# EAGLE design sha2017_proto_rev1_0_0 (EAGLE 6.6.0)
Assembly variants: PRODUCTION
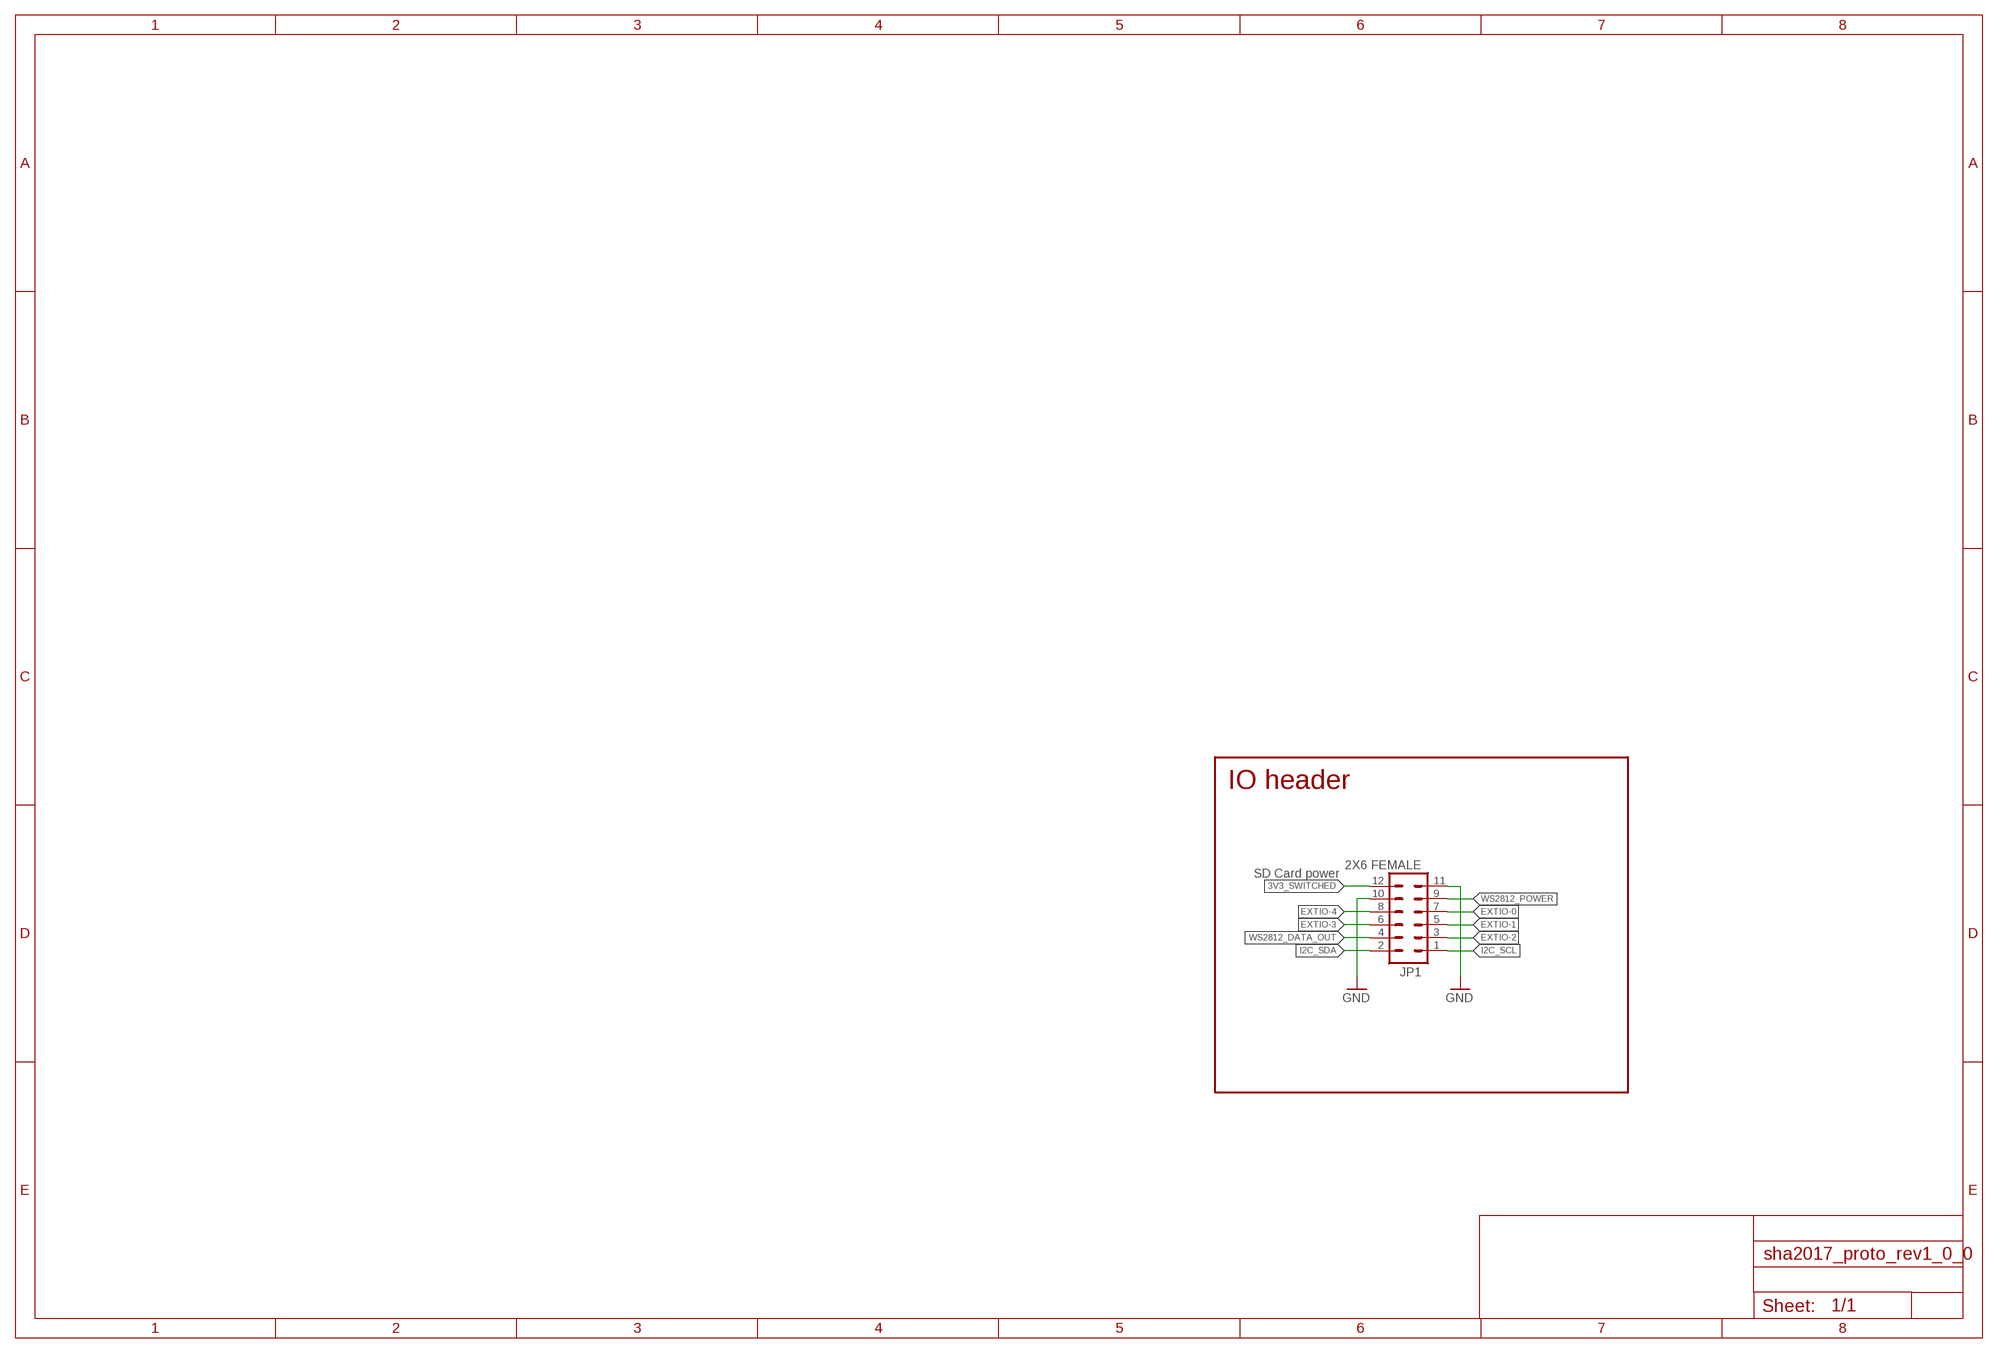
[diagram p0: schematic, sheet 1]

## Parts
JP1  2X6 FEMALE  M06X2PTH_FEMALE  [2X6]

## Nets
3V3_SWITCHED: JP1.12
EXTIO-0: JP1.7
EXTIO-1: JP1.5
EXTIO-2: JP1.3
EXTIO-3: JP1.6
EXTIO-4: JP1.8
GND [GND/3V3]: JP1.10 JP1.11
I2C_SCL: JP1.1
I2C_SDA: JP1.2
WS2812_DATA_OUT: JP1.4
WS2812_POWER: JP1.9

## Notes on the sheet
- IO header
- SD Card power

## Library data of the parts
JP1 = SparkFun-Connectors:M06X2; PROD_ID: CONN-12423

## Net classes
1 FAT: width 0.2 mm, drill 0.4 mm
2 GND/3V3: width 0.2 mm, drill 0.4 mm
3 Touch: width 0.2 mm, clearance 1 mm
4 touch prox: width 0.2 mm, clearance 1.6 mm

## Board
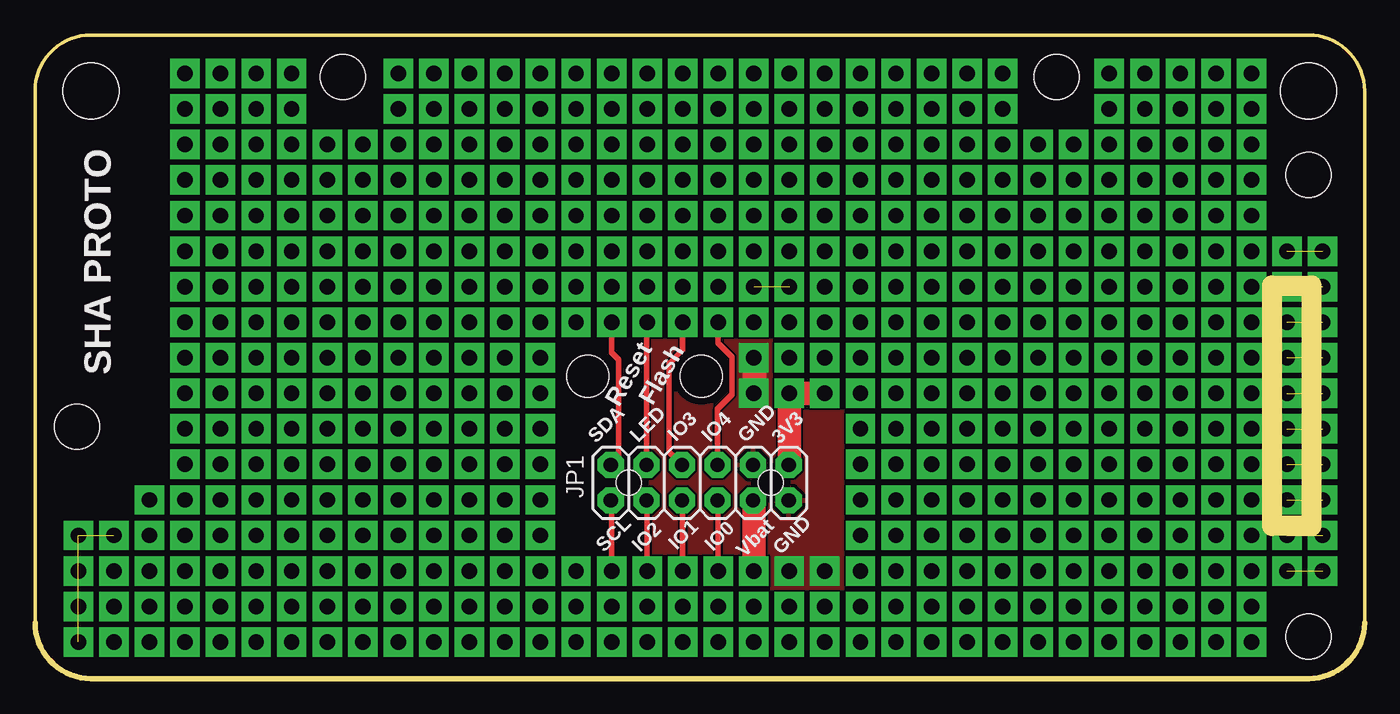
[diagram p1: board, top side]
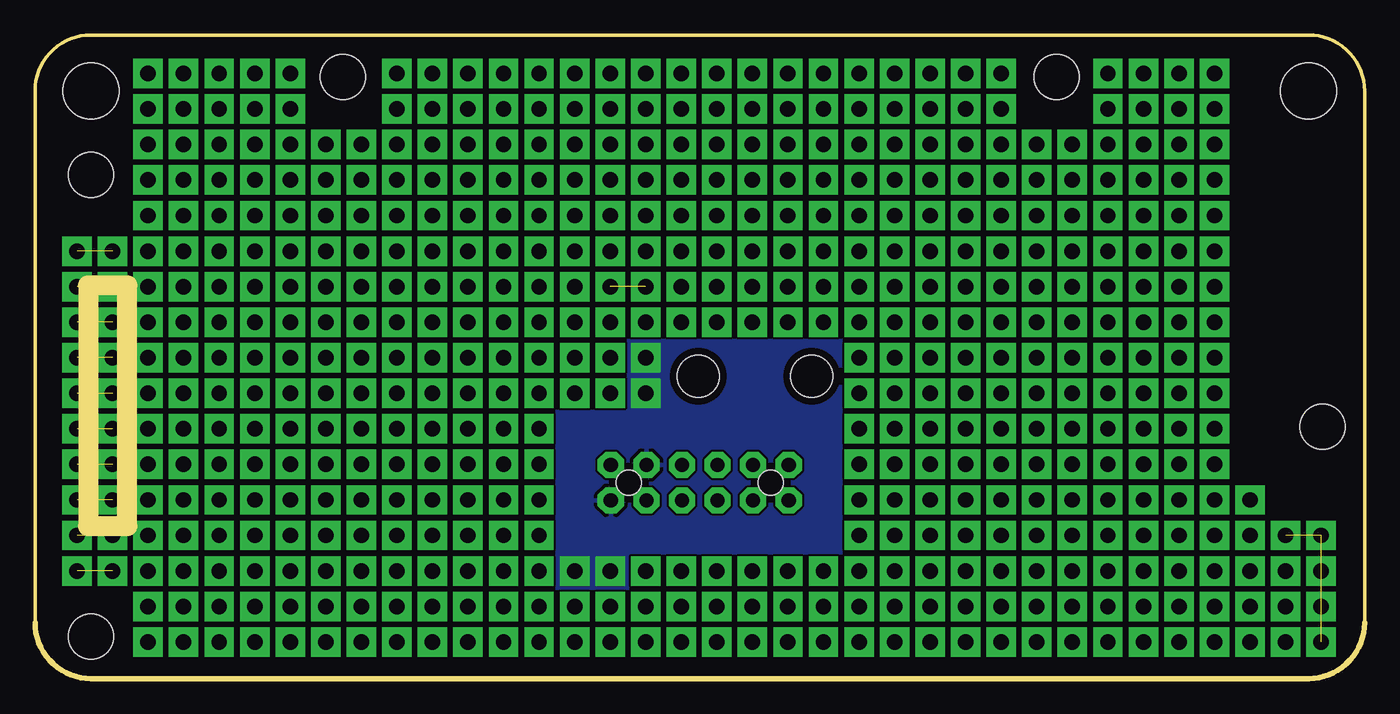
[diagram p2: board, bottom side, seen from below]

Size 95 x 46 mm. Coordinates in mm from the lower left corner, seen from the top.
Outline: 91,46 4,46 arc90 0,42 0,4 arc90 4,0 91,0 arc90 95,4 95,42 arc90 91,46
Copper layers (1*16): Top 0.035mm / dielectric 1.6mm / Bottom 0.035mm
Design rules "Elecrow_2-layer_PCB_eagle_rule": minimum track width 6mil, minimum drill 12mil, track to track 6mil, track to pad 6mil, pad to pad 6mil, via to via 8mil, smd to smd 0mil, copper to edge 20mil, drill to drill 10mil, minimum pad ring 6mil, minimum via ring 6mil, stop-mask expansion 0mil, vias tented up to drill 100mil, thermal gap 10mil
Holes 4 mm at 91,42 4,42
Holes 3.2 mm at 3,18 91,3 91,36 22,43 73,43
Holes 1.8 mm at 42.42,14 52.58,14
Holes 3 mm at 39.5,21.6 47.6,21.6
tRestrict: area -0.3,16.1 to 8.2,46.1
bRestrict: area -0.3,16.1 to 8.2,46.1
Milling: 4 lines

### Footprints (pad centres in the part's own frame; a part is rotated, then mirrored left to right if it is on the bottom)
2X6 = drill 1.016 pad 1.88 octagon: 1 0,0; 2 0,2.54; 3 2.54,0; 4 2.54,2.54; 5 5.08,0; 6 5.08,2.54; 7 7.62,0; 8 7.62,2.54; 9 10.16,0; 10 10.16,2.54; 11 12.7,0; 12 12.7,2.54

### Placement (x,y rotation side)
JP1  41.15,12.73 0 top

### Tracks (layer width: path | path; a pad name or v marks a point on that pad's centre or on a via)
3V3_SWITCHED  (via drill 1.1 pad 2.1)
  Top 1.676: JP1.12 53.9,15.27 v53.9,20.39 v56.44,20.39
EXTIO-0  (via drill 1.1 pad 2.1)
  Top 0.406: JP1.7 48.82,12.73 v48.82,7.69
EXTIO-1  (via drill 1.1 pad 2.1)
  Top 0.406: JP1.5 46.28,12.73 v46.28,7.69
EXTIO-2  (via drill 1.1 pad 2.1)
  Top 0.406: JP1.3 43.74,12.73 v43.74,7.69
EXTIO-3  (via drill 1.1 pad 2.1)
  Top 0.406: v46.28,25.47 46.28,23.48 45.4,22.6 45.3,22.5 45.3,16.2 JP1.6
EXTIO-4  (via drill 1.1 pad 2.1)
  Top 0.406: JP1.8 48.77,19.27 49.8,20.3 49.8,23 48.8,24 48.8,24.8 48.8,25.45 v48.82,25.47
GND  (via drill 1.1 pad 2.1)
  Top 1.676: v51.36,22.93 51.4,22.93 51.4,20.4
  other vias: 53.9,7.69 56.44,7.69 51.36,20.39
  pour Bottom (rank 6): 95.2,42 95.3,0.9 -0.3,1.3 0.6,43.1 arc-90 3.6,46.1 90.7,46.2 arc-90
  pour Top (rank 6): -0.6,46.4 96.1,46.4 96.1,0.9 -1.1,0.9 -1.1,46.5
I2C_SCL  (via drill 1.1 pad 2.1)
  Top 0.406: JP1.1 41.2,12.73 v41.2,7.69
I2C_SDA  (via drill 1.1 pad 2.1)
  Top 0.406: v41.2,25.47 41.2,23.3 41.7,22.8 41.7,15.82 JP1.2
N$9  (via drill 1.1 pad 2.1)
  other vias: 58.98,7.69
N$10  (via drill 1.1 pad 2.1)
  other vias: 61.52,7.69
N$11  (via drill 1.1 pad 2.1)
  other vias: 64.06,7.69
N$12  (via drill 1.1 pad 2.1)
  other vias: 66.6,7.69
N$13  (via drill 1.1 pad 2.1)
  other vias: 69.14,7.69
N$14  (via drill 1.1 pad 2.1)
  other vias: 71.68,7.69
N$15  (via drill 1.1 pad 2.1)
  other vias: 74.22,7.69
N$16  (via drill 1.1 pad 2.1)
  other vias: 76.76,7.69
N$17  (via drill 1.1 pad 2.1)
  other vias: 79.3,7.69
N$18  (via drill 1.1 pad 2.1)
  other vias: 81.84,7.69
N$19  (via drill 1.1 pad 2.1)
  other vias: 5.64,5.15
N$20  (via drill 1.1 pad 2.1)
  other vias: 84.38,7.69
N$21  (via drill 1.1 pad 2.1)
  other vias: 86.92,7.69
N$22  (via drill 1.1 pad 2.1)  (1 unrouted)
  other vias: 89.46,7.69 92,7.69
N$25  (via drill 1.1 pad 2.1)
  other vias: 8.18,5.15
N$26  (via drill 1.1 pad 2.1)
  other vias: 10.72,5.15
N$27  (via drill 1.1 pad 2.1)
  other vias: 13.26,5.15
N$28  (via drill 1.1 pad 2.1)
  other vias: 15.8,5.15
N$32  (via drill 1.1 pad 2.1)
  other vias: 18.34,5.15
N$42  (via drill 1.1 pad 2.1)
  other vias: 20.88,5.15
N$43  (via drill 1.1 pad 2.1)
  other vias: 23.42,5.15
N$44  (via drill 1.1 pad 2.1)
  other vias: 25.96,5.15
N$45  (via drill 1.1 pad 2.1)
  other vias: 28.5,5.15
N$46  (via drill 1.1 pad 2.1)
  other vias: 31.04,5.15
N$47  (via drill 1.1 pad 2.1)
  other vias: 33.58,5.15
N$48  (via drill 1.1 pad 2.1)
  other vias: 36.12,5.15
N$49  (via drill 1.1 pad 2.1)
  other vias: 38.66,5.15
N$50  (via drill 1.1 pad 2.1)
  other vias: 41.2,5.15
N$51  (via drill 1.1 pad 2.1)
  other vias: 43.74,5.15
N$52  (via drill 1.1 pad 2.1)
  other vias: 46.28,5.15
N$53  (via drill 1.1 pad 2.1)
  other vias: 48.82,5.15
N$54  (via drill 1.1 pad 2.1)
  other vias: 51.36,5.15
N$55  (via drill 1.1 pad 2.1)
  other vias: 53.9,5.15
N$56  (via drill 1.1 pad 2.1)
  other vias: 56.44,5.15
N$57  (via drill 1.1 pad 2.1)
  other vias: 5.64,7.69
N$58  (via drill 1.1 pad 2.1)
  other vias: 8.18,7.69
N$59  (via drill 1.1 pad 2.1)
  other vias: 10.72,7.69
N$60  (via drill 1.1 pad 2.1)
  other vias: 13.26,7.69
N$61  (via drill 1.1 pad 2.1)
  other vias: 15.8,7.69
N$62  (via drill 1.1 pad 2.1)
  other vias: 18.34,7.69
N$63  (via drill 1.1 pad 2.1)
  other vias: 20.88,7.69
N$64  (via drill 1.1 pad 2.1)
  other vias: 23.42,7.69
N$65  (via drill 1.1 pad 2.1)
  other vias: 25.96,7.69
N$66  (via drill 1.1 pad 2.1)
  other vias: 28.5,7.69
N$67  (via drill 1.1 pad 2.1)
  other vias: 31.04,7.69
N$68  (via drill 1.1 pad 2.1)
  other vias: 33.58,7.69
N$69  (via drill 1.1 pad 2.1)
  other vias: 36.12,7.69
N$70  (via drill 1.1 pad 2.1)
  other vias: 38.66,7.69
N$72  (via drill 1.1 pad 2.1)
  other vias: 5.64,2.61
N$73  (via drill 1.1 pad 2.1)
  other vias: 58.98,2.61
N$74  (via drill 1.1 pad 2.1)
  other vias: 61.52,2.61
N$75  (via drill 1.1 pad 2.1)
  other vias: 64.06,2.61
N$76  (via drill 1.1 pad 2.1)
  other vias: 66.6,2.61
N$77  (via drill 1.1 pad 2.1)
  other vias: 69.14,2.61
N$78  (via drill 1.1 pad 2.1)
  other vias: 71.68,2.61
N$79  (via drill 1.1 pad 2.1)
  other vias: 74.22,2.61
N$80  (via drill 1.1 pad 2.1)
  other vias: 76.76,2.61
N$81  (via drill 1.1 pad 2.1)
  other vias: 79.3,2.61
N$82  (via drill 1.1 pad 2.1)
  other vias: 81.84,2.61
N$83  (via drill 1.1 pad 2.1)
  other vias: 84.38,2.61
N$84  (via drill 1.1 pad 2.1)
  other vias: 86.92,2.61
N$86  (via drill 1.1 pad 2.1)
  other vias: 8.18,2.61
N$87  (via drill 1.1 pad 2.1)
  other vias: 10.72,2.61
N$88  (via drill 1.1 pad 2.1)
  other vias: 13.26,2.61
N$89  (via drill 1.1 pad 2.1)
  other vias: 58.98,5.15
N$90  (via drill 1.1 pad 2.1)
  other vias: 61.52,5.15
N$91  (via drill 1.1 pad 2.1)
  other vias: 64.06,5.15
N$92  (via drill 1.1 pad 2.1)
  other vias: 66.6,5.15
N$93  (via drill 1.1 pad 2.1)
  other vias: 69.14,5.15
N$94  (via drill 1.1 pad 2.1)
  other vias: 71.68,5.15
N$95  (via drill 1.1 pad 2.1)
  other vias: 74.22,5.15
N$96  (via drill 1.1 pad 2.1)
  other vias: 76.76,5.15
N$97  (via drill 1.1 pad 2.1)
  other vias: 79.3,5.15
N$98  (via drill 1.1 pad 2.1)
  other vias: 81.84,5.15
N$99  (via drill 1.1 pad 2.1)
  other vias: 84.38,5.15
N$100  (via drill 1.1 pad 2.1)
  other vias: 86.92,5.15
N$102  (via drill 1.1 pad 2.1)
  other vias: 15.8,2.61
N$103  (via drill 1.1 pad 2.1)
  other vias: 18.34,2.61
N$104  (via drill 1.1 pad 2.1)
  other vias: 20.88,2.61
N$105  (via drill 1.1 pad 2.1)
  other vias: 23.42,2.61
N$106  (via drill 1.1 pad 2.1)
  other vias: 25.96,2.61
N$107  (via drill 1.1 pad 2.1)
  other vias: 28.5,2.61
N$108  (via drill 1.1 pad 2.1)
  other vias: 31.04,2.61
N$109  (via drill 1.1 pad 2.1)
  other vias: 33.58,2.61
N$110  (via drill 1.1 pad 2.1)
  other vias: 36.12,2.61
N$111  (via drill 1.1 pad 2.1)
  other vias: 38.66,2.61
N$112  (via drill 1.1 pad 2.1)
  other vias: 41.2,2.61
N$113  (via drill 1.1 pad 2.1)
  other vias: 43.74,2.61
N$114  (via drill 1.1 pad 2.1)
  other vias: 46.28,2.61
N$115  (via drill 1.1 pad 2.1)
  other vias: 48.82,2.61
N$116  (via drill 1.1 pad 2.1)
  other vias: 51.36,2.61
N$117  (via drill 1.1 pad 2.1)
  other vias: 53.9,2.61
N$118  (via drill 1.1 pad 2.1)
  other vias: 56.44,2.61
N$125  (via drill 1.1 pad 2.1)
  other vias: 58.98,10.23
N$126  (via drill 1.1 pad 2.1)
  other vias: 61.52,10.23
N$127  (via drill 1.1 pad 2.1)
  other vias: 64.06,10.23
N$128  (via drill 1.1 pad 2.1)
  other vias: 66.6,10.23
N$129  (via drill 1.1 pad 2.1)
  other vias: 69.14,10.23
N$130  (via drill 1.1 pad 2.1)
  other vias: 71.68,10.23
N$131  (via drill 1.1 pad 2.1)
  other vias: 74.22,10.23
N$132  (via drill 1.1 pad 2.1)
  other vias: 76.76,10.23
N$133  (via drill 1.1 pad 2.1)
  other vias: 79.3,10.23
N$134  (via drill 1.1 pad 2.1)
  other vias: 81.84,10.23
N$135  (via drill 1.1 pad 2.1)
  other vias: 84.38,10.23
N$136  (via drill 1.1 pad 2.1)
  other vias: 86.92,10.23
N$137  (via drill 1.1 pad 2.1)  (1 unrouted)
  other vias: 89.46,10.23 92,10.23
N$140  (via drill 1.1 pad 2.1)  (4 unrouted)
  other vias: 5.64,10.23 3.1,10.23 3.1,7.69 3.1,5.15 3.1,2.61
N$141  (via drill 1.1 pad 2.1)
  other vias: 8.18,10.23
N$142  (via drill 1.1 pad 2.1)
  other vias: 10.72,10.23
N$143  (via drill 1.1 pad 2.1)
  other vias: 13.26,10.23
N$144  (via drill 1.1 pad 2.1)
  other vias: 15.8,10.23
N$145  (via drill 1.1 pad 2.1)
  other vias: 18.34,10.23
N$146  (via drill 1.1 pad 2.1)
  other vias: 20.88,10.23
N$147  (via drill 1.1 pad 2.1)
  other vias: 23.42,10.23
N$148  (via drill 1.1 pad 2.1)
  other vias: 25.96,10.23
N$149  (via drill 1.1 pad 2.1)
  other vias: 28.5,10.23
N$150  (via drill 1.1 pad 2.1)
  other vias: 31.04,10.23
N$151  (via drill 1.1 pad 2.1)
  other vias: 33.58,10.23
N$152  (via drill 1.1 pad 2.1)
  other vias: 36.12,10.23
N$155  (via drill 1.1 pad 2.1)
  other vias: 58.98,12.77
N$156  (via drill 1.1 pad 2.1)
  other vias: 61.52,12.77
N$157  (via drill 1.1 pad 2.1)
  other vias: 64.06,12.77
N$158  (via drill 1.1 pad 2.1)
  other vias: 66.6,12.77
N$159  (via drill 1.1 pad 2.1)
  other vias: 69.14,12.77
N$160  (via drill 1.1 pad 2.1)
  other vias: 71.68,12.77
N$161  (via drill 1.1 pad 2.1)
  other vias: 74.22,12.77
N$162  (via drill 1.1 pad 2.1)
  other vias: 76.76,12.77
N$163  (via drill 1.1 pad 2.1)
  other vias: 79.3,12.77
N$164  (via drill 1.1 pad 2.1)
  other vias: 81.84,12.77
N$165  (via drill 1.1 pad 2.1)
  other vias: 84.38,12.77
N$166  (via drill 1.1 pad 2.1)
  other vias: 86.92,12.77
N$167  (via drill 1.1 pad 2.1)  (1 unrouted)
  other vias: 89.46,12.77 92,12.77
N$169  (via drill 1.1 pad 2.1)
  other vias: 8.18,12.77
N$170  (via drill 1.1 pad 2.1)
  other vias: 10.72,12.77
N$171  (via drill 1.1 pad 2.1)
  other vias: 13.26,12.77
N$172  (via drill 1.1 pad 2.1)
  other vias: 15.8,12.77
N$173  (via drill 1.1 pad 2.1)
  other vias: 18.34,12.77
N$174  (via drill 1.1 pad 2.1)
  other vias: 20.88,12.77
N$175  (via drill 1.1 pad 2.1)
  other vias: 23.42,12.77
N$176  (via drill 1.1 pad 2.1)
  other vias: 25.96,12.77
N$177  (via drill 1.1 pad 2.1)
  other vias: 28.5,12.77
N$178  (via drill 1.1 pad 2.1)
  other vias: 31.04,12.77
N$179  (via drill 1.1 pad 2.1)
  other vias: 33.58,12.77
N$180  (via drill 1.1 pad 2.1)
  other vias: 36.12,12.77
N$189  (via drill 1.1 pad 2.1)
  other vias: 58.98,15.31
N$190  (via drill 1.1 pad 2.1)
  other vias: 61.52,15.31
N$191  (via drill 1.1 pad 2.1)
  other vias: 64.06,15.31
N$192  (via drill 1.1 pad 2.1)
  other vias: 66.6,15.31
N$193  (via drill 1.1 pad 2.1)
  other vias: 69.14,15.31
N$194  (via drill 1.1 pad 2.1)
  other vias: 71.68,15.31
N$195  (via drill 1.1 pad 2.1)
  other vias: 74.22,15.31
N$196  (via drill 1.1 pad 2.1)
  other vias: 76.76,15.31
N$197  (via drill 1.1 pad 2.1)
  other vias: 79.3,15.31
N$198  (via drill 1.1 pad 2.1)
  other vias: 81.84,15.31
N$199  (via drill 1.1 pad 2.1)
  other vias: 84.38,15.31
N$200  (via drill 1.1 pad 2.1)
  other vias: 86.92,15.31
N$201  (via drill 1.1 pad 2.1)  (1 unrouted)
  other vias: 89.46,15.31 92,15.31
N$204  (via drill 1.1 pad 2.1)
  other vias: 10.72,15.31
N$205  (via drill 1.1 pad 2.1)
  other vias: 13.26,15.31
N$206  (via drill 1.1 pad 2.1)
  other vias: 15.8,15.31
N$207  (via drill 1.1 pad 2.1)
  other vias: 18.34,15.31
N$208  (via drill 1.1 pad 2.1)
  other vias: 20.88,15.31
N$209  (via drill 1.1 pad 2.1)
  other vias: 23.42,15.31
N$210  (via drill 1.1 pad 2.1)
  other vias: 25.96,15.31
N$211  (via drill 1.1 pad 2.1)
  other vias: 28.5,15.31
N$212  (via drill 1.1 pad 2.1)
  other vias: 31.04,15.31
N$213  (via drill 1.1 pad 2.1)
  other vias: 33.58,15.31
N$214  (via drill 1.1 pad 2.1)
  other vias: 36.12,15.31
N$223  (via drill 1.1 pad 2.1)
  other vias: 58.98,17.85
N$224  (via drill 1.1 pad 2.1)
  other vias: 61.52,17.85
N$225  (via drill 1.1 pad 2.1)
  other vias: 64.06,17.85
N$226  (via drill 1.1 pad 2.1)
  other vias: 66.6,17.85
N$227  (via drill 1.1 pad 2.1)
  other vias: 69.14,17.85
N$228  (via drill 1.1 pad 2.1)
  other vias: 71.68,17.85
N$229  (via drill 1.1 pad 2.1)
  other vias: 74.22,17.85
N$230  (via drill 1.1 pad 2.1)
  other vias: 76.76,17.85
N$231  (via drill 1.1 pad 2.1)
  other vias: 79.3,17.85
N$232  (via drill 1.1 pad 2.1)
  other vias: 81.84,17.85
N$233  (via drill 1.1 pad 2.1)
  other vias: 84.38,17.85
N$234  (via drill 1.1 pad 2.1)
  other vias: 86.92,17.85
N$235  (via drill 1.1 pad 2.1)  (1 unrouted)
  other vias: 89.46,17.85 92,17.85
N$238  (via drill 1.1 pad 2.1)
  other vias: 10.72,17.85
N$239  (via drill 1.1 pad 2.1)
  other vias: 13.26,17.85
N$240  (via drill 1.1 pad 2.1)
  other vias: 15.8,17.85
N$241  (via drill 1.1 pad 2.1)
  other vias: 18.34,17.85
N$242  (via drill 1.1 pad 2.1)
  other vias: 20.88,17.85
N$243  (via drill 1.1 pad 2.1)
  other vias: 23.42,17.85
N$244  (via drill 1.1 pad 2.1)
  other vias: 25.96,17.85
N$245  (via drill 1.1 pad 2.1)
  other vias: 28.5,17.85
N$246  (via drill 1.1 pad 2.1)
  other vias: 31.04,17.85
N$247  (via drill 1.1 pad 2.1)
  other vias: 33.58,17.85
N$248  (via drill 1.1 pad 2.1)
  other vias: 36.12,17.85
N$257  (via drill 1.1 pad 2.1)
  other vias: 58.98,20.39
N$258  (via drill 1.1 pad 2.1)
  other vias: 61.52,20.39
N$259  (via drill 1.1 pad 2.1)
  other vias: 64.06,20.39
N$260  (via drill 1.1 pad 2.1)
  other vias: 66.6,20.39
N$261  (via drill 1.1 pad 2.1)
  other vias: 69.14,20.39
N$262  (via drill 1.1 pad 2.1)
  other vias: 71.68,20.39
N$263  (via drill 1.1 pad 2.1)
  other vias: 74.22,20.39
N$264  (via drill 1.1 pad 2.1)
  other vias: 76.76,20.39
N$265  (via drill 1.1 pad 2.1)
  other vias: 79.3,20.39
N$266  (via drill 1.1 pad 2.1)
  other vias: 81.84,20.39
N$267  (via drill 1.1 pad 2.1)
  other vias: 84.38,20.39
N$268  (via drill 1.1 pad 2.1)
  other vias: 86.92,20.39
N$269  (via drill 1.1 pad 2.1)  (1 unrouted)
  other vias: 89.46,20.39 92,20.39
N$272  (via drill 1.1 pad 2.1)
  other vias: 10.72,20.39
N$273  (via drill 1.1 pad 2.1)
  other vias: 13.26,20.39
N$274  (via drill 1.1 pad 2.1)
  other vias: 15.8,20.39
N$275  (via drill 1.1 pad 2.1)
  other vias: 18.34,20.39
N$276  (via drill 1.1 pad 2.1)
  other vias: 20.88,20.39
N$277  (via drill 1.1 pad 2.1)
  other vias: 23.42,20.39
N$278  (via drill 1.1 pad 2.1)
  other vias: 25.96,20.39
N$279  (via drill 1.1 pad 2.1)
  other vias: 28.5,20.39
N$280  (via drill 1.1 pad 2.1)
  other vias: 31.04,20.39
N$281  (via drill 1.1 pad 2.1)
  other vias: 33.58,20.39
N$282  (via drill 1.1 pad 2.1)
  other vias: 36.12,20.39
N$289  (via drill 1.1 pad 2.1)
  other vias: 53.9,22.93
N$290  (via drill 1.1 pad 2.1)
  other vias: 56.44,22.93
N$291  (via drill 1.1 pad 2.1)
  other vias: 58.98,22.93
N$292  (via drill 1.1 pad 2.1)
  other vias: 61.52,22.93
N$293  (via drill 1.1 pad 2.1)
  other vias: 64.06,22.93
N$294  (via drill 1.1 pad 2.1)
  other vias: 66.6,22.93
N$295  (via drill 1.1 pad 2.1)
  other vias: 69.14,22.93
N$296  (via drill 1.1 pad 2.1)
  other vias: 71.68,22.93
N$297  (via drill 1.1 pad 2.1)
  other vias: 74.22,22.93
N$298  (via drill 1.1 pad 2.1)
  other vias: 76.76,22.93
N$299  (via drill 1.1 pad 2.1)
  other vias: 79.3,22.93
N$300  (via drill 1.1 pad 2.1)
  other vias: 81.84,22.93
N$301  (via drill 1.1 pad 2.1)
  other vias: 84.38,22.93
N$302  (via drill 1.1 pad 2.1)
  other vias: 86.92,22.93
N$303  (via drill 1.1 pad 2.1)  (1 unrouted)
  other vias: 89.46,22.93 92,22.93
N$306  (via drill 1.1 pad 2.1)
  other vias: 10.72,22.93
N$307  (via drill 1.1 pad 2.1)
  other vias: 13.26,22.93
N$308  (via drill 1.1 pad 2.1)
  other vias: 15.8,22.93
N$309  (via drill 1.1 pad 2.1)
  other vias: 18.34,22.93
N$310  (via drill 1.1 pad 2.1)
  other vias: 20.88,22.93
N$311  (via drill 1.1 pad 2.1)
  other vias: 23.42,22.93
N$312  (via drill 1.1 pad 2.1)
  other vias: 25.96,22.93
N$313  (via drill 1.1 pad 2.1)
  other vias: 28.5,22.93
N$314  (via drill 1.1 pad 2.1)
  other vias: 31.04,22.93
N$315  (via drill 1.1 pad 2.1)
  other vias: 33.58,22.93
N$316  (via drill 1.1 pad 2.1)
  other vias: 36.12,22.93
N$322  (via drill 1.1 pad 2.1)
  other vias: 51.36,25.47
N$323  (via drill 1.1 pad 2.1)
  other vias: 53.9,25.47
N$324  (via drill 1.1 pad 2.1)
  other vias: 56.44,25.47
N$325  (via drill 1.1 pad 2.1)
  other vias: 58.98,25.47
N$326  (via drill 1.1 pad 2.1)
  other vias: 61.52,25.47
N$327  (via drill 1.1 pad 2.1)
  other vias: 64.06,25.47
N$328  (via drill 1.1 pad 2.1)
  other vias: 66.6,25.47
N$329  (via drill 1.1 pad 2.1)
  other vias: 69.14,25.47
N$330  (via drill 1.1 pad 2.1)
  other vias: 71.68,25.47
N$331  (via drill 1.1 pad 2.1)
  other vias: 74.22,25.47
N$332  (via drill 1.1 pad 2.1)
  other vias: 76.76,25.47
N$333  (via drill 1.1 pad 2.1)
  other vias: 79.3,25.47
N$334  (via drill 1.1 pad 2.1)
  other vias: 81.84,25.47
N$335  (via drill 1.1 pad 2.1)
  other vias: 84.38,25.47
N$336  (via drill 1.1 pad 2.1)
  other vias: 86.92,25.47
N$337  (via drill 1.1 pad 2.1)  (1 unrouted)
  other vias: 89.46,25.47 92,25.47
N$340  (via drill 1.1 pad 2.1)
  other vias: 10.72,25.47
N$341  (via drill 1.1 pad 2.1)
  other vias: 13.26,25.47
N$342  (via drill 1.1 pad 2.1)
  other vias: 15.8,25.47
N$343  (via drill 1.1 pad 2.1)
  other vias: 18.34,25.47
N$344  (via drill 1.1 pad 2.1)
  other vias: 20.88,25.47
N$345  (via drill 1.1 pad 2.1)
  other vias: 23.42,25.47
N$346  (via drill 1.1 pad 2.1)
  other vias: 25.96,25.47
N$347  (via drill 1.1 pad 2.1)
  other vias: 28.5,25.47
N$348  (via drill 1.1 pad 2.1)
  other vias: 31.04,25.47
N$349  (via drill 1.1 pad 2.1)
  other vias: 33.58,25.47
N$350  (via drill 1.1 pad 2.1)
  other vias: 36.12,25.47
N$351  (via drill 1.1 pad 2.1)
  other vias: 38.66,25.47
N$353  (via drill 1.1 pad 2.1)
  other vias: 43.74,28.01
N$354  (via drill 1.1 pad 2.1)
  other vias: 46.28,28.01
N$355  (via drill 1.1 pad 2.1)
  other vias: 48.82,28.01
N$356  (via drill 1.1 pad 2.1)  (1 unrouted)
  other vias: 51.36,28.01 53.9,28.01
N$358  (via drill 1.1 pad 2.1)
  other vias: 56.44,28.01
N$359  (via drill 1.1 pad 2.1)
  other vias: 58.98,28.01
N$360  (via drill 1.1 pad 2.1)
  other vias: 61.52,28.01
N$361  (via drill 1.1 pad 2.1)
  other vias: 64.06,28.01
N$362  (via drill 1.1 pad 2.1)
  other vias: 66.6,28.01
N$363  (via drill 1.1 pad 2.1)
  other vias: 69.14,28.01
N$364  (via drill 1.1 pad 2.1)
  other vias: 71.68,28.01
N$365  (via drill 1.1 pad 2.1)
  other vias: 74.22,28.01
N$366  (via drill 1.1 pad 2.1)
  other vias: 76.76,28.01
N$367  (via drill 1.1 pad 2.1)
  other vias: 79.3,28.01
N$368  (via drill 1.1 pad 2.1)
  other vias: 81.84,28.01
N$369  (via drill 1.1 pad 2.1)
  other vias: 84.38,28.01
N$370  (via drill 1.1 pad 2.1)
  other vias: 86.92,28.01
N$371  (via drill 1.1 pad 2.1)  (1 unrouted)
  other vias: 89.46,28.01 92,28.01
N$374  (via drill 1.1 pad 2.1)
  other vias: 10.72,28.01
N$375  (via drill 1.1 pad 2.1)
  other vias: 13.26,28.01
N$376  (via drill 1.1 pad 2.1)
  other vias: 15.8,28.01
N$377  (via drill 1.1 pad 2.1)
  other vias: 18.34,28.01
N$378  (via drill 1.1 pad 2.1)
  other vias: 20.88,28.01
N$379  (via drill 1.1 pad 2.1)
  other vias: 23.42,28.01
N$380  (via drill 1.1 pad 2.1)
  other vias: 25.96,28.01
N$381  (via drill 1.1 pad 2.1)
  other vias: 28.5,28.01
N$382  (via drill 1.1 pad 2.1)
  other vias: 31.04,28.01
N$383  (via drill 1.1 pad 2.1)
  other vias: 33.58,28.01
N$384  (via drill 1.1 pad 2.1)
  other vias: 36.12,28.01
N$385  (via drill 1.1 pad 2.1)
  other vias: 38.66,28.01
N$386  (via drill 1.1 pad 2.1)
  other vias: 41.2,28.01
N$387  (via drill 1.1 pad 2.1)
  other vias: 43.74,30.55
N$388  (via drill 1.1 pad 2.1)
  other vias: 46.28,30.55
N$389  (via drill 1.1 pad 2.1)
  other vias: 48.82,30.55
N$390  (via drill 1.1 pad 2.1)
  other vias: 51.36,30.55
N$391  (via drill 1.1 pad 2.1)
  other vias: 53.9,30.55
N$392  (via drill 1.1 pad 2.1)
  other vias: 56.44,30.55
N$393  (via drill 1.1 pad 2.1)
  other vias: 58.98,30.55
N$394  (via drill 1.1 pad 2.1)
  other vias: 61.52,30.55
N$395  (via drill 1.1 pad 2.1)
  other vias: 64.06,30.55
N$396  (via drill 1.1 pad 2.1)
  other vias: 66.6,30.55
N$397  (via drill 1.1 pad 2.1)
  other vias: 69.14,30.55
N$398  (via drill 1.1 pad 2.1)
  other vias: 71.68,30.55
N$399  (via drill 1.1 pad 2.1)
  other vias: 74.22,30.55
N$400  (via drill 1.1 pad 2.1)
  other vias: 76.76,30.55
N$401  (via drill 1.1 pad 2.1)
  other vias: 79.3,30.55
N$402  (via drill 1.1 pad 2.1)
  other vias: 81.84,30.55
N$403  (via drill 1.1 pad 2.1)
  other vias: 84.38,30.55
N$404  (via drill 1.1 pad 2.1)
  other vias: 86.92,30.55
N$405  (via drill 1.1 pad 2.1)  (1 unrouted)
  other vias: 89.46,30.55 92,30.55
N$408  (via drill 1.1 pad 2.1)
  other vias: 10.72,30.55
N$409  (via drill 1.1 pad 2.1)
  other vias: 13.26,30.55
N$410  (via drill 1.1 pad 2.1)
  other vias: 15.8,30.55
N$411  (via drill 1.1 pad 2.1)
  other vias: 18.34,30.55
N$412  (via drill 1.1 pad 2.1)
  other vias: 20.88,30.55
N$413  (via drill 1.1 pad 2.1)
  other vias: 23.42,30.55
N$414  (via drill 1.1 pad 2.1)
  other vias: 25.96,30.55
N$415  (via drill 1.1 pad 2.1)
  other vias: 28.5,30.55
N$416  (via drill 1.1 pad 2.1)
  other vias: 31.04,30.55
N$417  (via drill 1.1 pad 2.1)
  other vias: 33.58,30.55
N$418  (via drill 1.1 pad 2.1)
  other vias: 36.12,30.55
N$419  (via drill 1.1 pad 2.1)
  other vias: 38.66,30.55
N$420  (via drill 1.1 pad 2.1)
  other vias: 41.2,30.55
N$421  (via drill 1.1 pad 2.1)
  other vias: 43.74,33.09
N$422  (via drill 1.1 pad 2.1)
  other vias: 46.28,33.09
N$423  (via drill 1.1 pad 2.1)
  other vias: 48.82,33.09
N$424  (via drill 1.1 pad 2.1)
  other vias: 51.36,33.09
N$425  (via drill 1.1 pad 2.1)
  other vias: 53.9,33.09
N$426  (via drill 1.1 pad 2.1)
  other vias: 56.44,33.09
N$427  (via drill 1.1 pad 2.1)
  other vias: 58.98,33.09
N$428  (via drill 1.1 pad 2.1)
  other vias: 61.52,33.09
N$429  (via drill 1.1 pad 2.1)
  other vias: 64.06,33.09
N$430  (via drill 1.1 pad 2.1)
  other vias: 66.6,33.09
N$431  (via drill 1.1 pad 2.1)
  other vias: 69.14,33.09
N$432  (via drill 1.1 pad 2.1)
  other vias: 71.68,33.09
N$433  (via drill 1.1 pad 2.1)
  other vias: 74.22,33.09
N$434  (via drill 1.1 pad 2.1)
  other vias: 76.76,33.09
N$435  (via drill 1.1 pad 2.1)
  other vias: 79.3,33.09
N$436  (via drill 1.1 pad 2.1)
  other vias: 81.84,33.09
N$437  (via drill 1.1 pad 2.1)
  other vias: 84.38,33.09
N$438  (via drill 1.1 pad 2.1)
  other vias: 86.92,33.09
N$442  (via drill 1.1 pad 2.1)
  other vias: 10.72,33.09
N$443  (via drill 1.1 pad 2.1)
  other vias: 13.26,33.09
N$444  (via drill 1.1 pad 2.1)
  other vias: 15.8,33.09
N$445  (via drill 1.1 pad 2.1)
  other vias: 18.34,33.09
N$446  (via drill 1.1 pad 2.1)
  other vias: 20.88,33.09
N$447  (via drill 1.1 pad 2.1)
  other vias: 23.42,33.09
N$448  (via drill 1.1 pad 2.1)
  other vias: 25.96,33.09
N$449  (via drill 1.1 pad 2.1)
  other vias: 28.5,33.09
N$450  (via drill 1.1 pad 2.1)
  other vias: 31.04,33.09
N$451  (via drill 1.1 pad 2.1)
  other vias: 33.58,33.09
N$452  (via drill 1.1 pad 2.1)
  other vias: 36.12,33.09
N$453  (via drill 1.1 pad 2.1)
  other vias: 38.66,33.09
N$454  (via drill 1.1 pad 2.1)
  other vias: 41.2,33.09
N$455  (via drill 1.1 pad 2.1)
  other vias: 43.74,35.63
N$456  (via drill 1.1 pad 2.1)
  other vias: 46.28,35.63
N$457  (via drill 1.1 pad 2.1)
  other vias: 48.82,35.63
N$458  (via drill 1.1 pad 2.1)
  other vias: 51.36,35.63
N$459  (via drill 1.1 pad 2.1)
  other vias: 53.9,35.63
N$460  (via drill 1.1 pad 2.1)
  other vias: 56.44,35.63
N$461  (via drill 1.1 pad 2.1)
  other vias: 58.98,35.63
N$462  (via drill 1.1 pad 2.1)
  other vias: 61.52,35.63
N$463  (via drill 1.1 pad 2.1)
  other vias: 64.06,35.63
N$464  (via drill 1.1 pad 2.1)
  other vias: 66.6,35.63
N$465  (via drill 1.1 pad 2.1)
  other vias: 69.14,35.63
N$466  (via drill 1.1 pad 2.1)
  other vias: 71.68,35.63
N$467  (via drill 1.1 pad 2.1)
  other vias: 74.22,35.63
N$468  (via drill 1.1 pad 2.1)
  other vias: 76.76,35.63
N$469  (via drill 1.1 pad 2.1)
  other vias: 79.3,35.63
N$470  (via drill 1.1 pad 2.1)
  other vias: 81.84,35.63
N$471  (via drill 1.1 pad 2.1)
  other vias: 84.38,35.63
N$472  (via drill 1.1 pad 2.1)
  other vias: 86.92,35.63
N$476  (via drill 1.1 pad 2.1)
  other vias: 10.72,35.63
N$477  (via drill 1.1 pad 2.1)
  other vias: 13.26,35.63
N$478  (via drill 1.1 pad 2.1)
  other vias: 15.8,35.63
N$479  (via drill 1.1 pad 2.1)
  other vias: 18.34,35.63
N$480  (via drill 1.1 pad 2.1)
  other vias: 20.88,35.63
N$481  (via drill 1.1 pad 2.1)
  other vias: 23.42,35.63
N$482  (via drill 1.1 pad 2.1)
  other vias: 25.96,35.63
N$483  (via drill 1.1 pad 2.1)
  other vias: 28.5,35.63
N$484  (via drill 1.1 pad 2.1)
  other vias: 31.04,35.63
N$485  (via drill 1.1 pad 2.1)
  other vias: 33.58,35.63
N$486  (via drill 1.1 pad 2.1)
  other vias: 36.12,35.63
N$487  (via drill 1.1 pad 2.1)
  other vias: 38.66,35.63
N$488  (via drill 1.1 pad 2.1)
  other vias: 41.2,35.63
N$489  (via drill 1.1 pad 2.1)
  other vias: 43.74,38.17
N$490  (via drill 1.1 pad 2.1)
  other vias: 46.28,38.17
N$491  (via drill 1.1 pad 2.1)
  other vias: 48.82,38.17
N$492  (via drill 1.1 pad 2.1)
  other vias: 51.36,38.17
N$493  (via drill 1.1 pad 2.1)
  other vias: 53.9,38.17
N$494  (via drill 1.1 pad 2.1)
  other vias: 56.44,38.17
N$495  (via drill 1.1 pad 2.1)
  other vias: 58.98,38.17
N$496  (via drill 1.1 pad 2.1)
  other vias: 61.52,38.17
N$497  (via drill 1.1 pad 2.1)
  other vias: 64.06,38.17
N$498  (via drill 1.1 pad 2.1)
  other vias: 66.6,38.17
N$499  (via drill 1.1 pad 2.1)
  other vias: 69.14,38.17
N$500  (via drill 1.1 pad 2.1)
  other vias: 71.68,38.17
N$501  (via drill 1.1 pad 2.1)
  other vias: 74.22,38.17
N$502  (via drill 1.1 pad 2.1)
  other vias: 76.76,38.17
N$503  (via drill 1.1 pad 2.1)
  other vias: 79.3,38.17
N$504  (via drill 1.1 pad 2.1)
  other vias: 81.84,38.17
N$505  (via drill 1.1 pad 2.1)
  other vias: 84.38,38.17
N$506  (via drill 1.1 pad 2.1)
  other vias: 86.92,38.17
N$510  (via drill 1.1 pad 2.1)
  other vias: 10.72,38.17
N$511  (via drill 1.1 pad 2.1)
  other vias: 13.26,38.17
N$512  (via drill 1.1 pad 2.1)
  other vias: 15.8,38.17
N$513  (via drill 1.1 pad 2.1)
  other vias: 18.34,38.17
N$514  (via drill 1.1 pad 2.1)
  other vias: 20.88,38.17
N$515  (via drill 1.1 pad 2.1)
  other vias: 23.42,38.17
N$516  (via drill 1.1 pad 2.1)
  other vias: 25.96,38.17
N$517  (via drill 1.1 pad 2.1)
  other vias: 28.5,38.17
N$518  (via drill 1.1 pad 2.1)
  other vias: 31.04,38.17
N$519  (via drill 1.1 pad 2.1)
  other vias: 33.58,38.17
N$520  (via drill 1.1 pad 2.1)
  other vias: 36.12,38.17
N$521  (via drill 1.1 pad 2.1)
  other vias: 38.66,38.17
N$522  (via drill 1.1 pad 2.1)
  other vias: 41.2,38.17
N$523  (via drill 1.1 pad 2.1)
  other vias: 43.74,40.71
N$524  (via drill 1.1 pad 2.1)
  other vias: 46.28,40.71
N$525  (via drill 1.1 pad 2.1)
  other vias: 48.82,40.71
N$526  (via drill 1.1 pad 2.1)
  other vias: 51.36,40.71
N$527  (via drill 1.1 pad 2.1)
  other vias: 53.9,40.71
N$528  (via drill 1.1 pad 2.1)
  other vias: 56.44,40.71
N$529  (via drill 1.1 pad 2.1)
  other vias: 58.98,40.71
N$530  (via drill 1.1 pad 2.1)
  other vias: 61.52,40.71
N$531  (via drill 1.1 pad 2.1)
  other vias: 64.06,40.71
N$532  (via drill 1.1 pad 2.1)
  other vias: 66.6,40.71
N$533  (via drill 1.1 pad 2.1)
  other vias: 69.14,40.71
N$536  (via drill 1.1 pad 2.1)
  other vias: 76.76,40.71
N$537  (via drill 1.1 pad 2.1)
  other vias: 79.3,40.71
N$538  (via drill 1.1 pad 2.1)
  other vias: 81.84,40.71
N$539  (via drill 1.1 pad 2.1)
  other vias: 84.38,40.71
N$540  (via drill 1.1 pad 2.1)
  other vias: 86.92,40.71
N$544  (via drill 1.1 pad 2.1)
  other vias: 10.72,40.71
N$545  (via drill 1.1 pad 2.1)
  other vias: 13.26,40.71
N$546  (via drill 1.1 pad 2.1)
  other vias: 15.8,40.71
N$547  (via drill 1.1 pad 2.1)
  other vias: 18.34,40.71
N$550  (via drill 1.1 pad 2.1)
  other vias: 25.96,40.71
N$551  (via drill 1.1 pad 2.1)
  other vias: 28.5,40.71
N$552  (via drill 1.1 pad 2.1)
  other vias: 31.04,40.71
N$553  (via drill 1.1 pad 2.1)
  other vias: 33.58,40.71
N$554  (via drill 1.1 pad 2.1)
  other vias: 36.12,40.71
N$555  (via drill 1.1 pad 2.1)
  other vias: 38.66,40.71
N$556  (via drill 1.1 pad 2.1)
  other vias: 41.2,40.71
N$557  (via drill 1.1 pad 2.1)
  other vias: 43.74,43.25
N$558  (via drill 1.1 pad 2.1)
  other vias: 46.28,43.25
N$559  (via drill 1.1 pad 2.1)
  other vias: 48.82,43.25
N$560  (via drill 1.1 pad 2.1)
  other vias: 51.36,43.25
N$561  (via drill 1.1 pad 2.1)
  other vias: 53.9,43.25
N$562  (via drill 1.1 pad 2.1)
  other vias: 56.44,43.25
N$563  (via drill 1.1 pad 2.1)
  other vias: 58.98,43.25
N$564  (via drill 1.1 pad 2.1)
  other vias: 61.52,43.25
N$565  (via drill 1.1 pad 2.1)
  other vias: 64.06,43.25
N$566  (via drill 1.1 pad 2.1)
  other vias: 66.6,43.25
N$567  (via drill 1.1 pad 2.1)
  other vias: 69.14,43.25
N$570  (via drill 1.1 pad 2.1)
  other vias: 76.76,43.25
N$571  (via drill 1.1 pad 2.1)
  other vias: 79.3,43.25
N$572  (via drill 1.1 pad 2.1)
  other vias: 81.84,43.25
N$573  (via drill 1.1 pad 2.1)
  other vias: 84.38,43.25
N$574  (via drill 1.1 pad 2.1)
  other vias: 86.92,43.25
N$578  (via drill 1.1 pad 2.1)
  other vias: 10.72,43.25
N$579  (via drill 1.1 pad 2.1)
  other vias: 13.26,43.25
N$580  (via drill 1.1 pad 2.1)
  other vias: 15.8,43.25
N$581  (via drill 1.1 pad 2.1)
  other vias: 18.34,43.25
N$584  (via drill 1.1 pad 2.1)
  other vias: 25.96,43.25
N$585  (via drill 1.1 pad 2.1)
  other vias: 28.5,43.25
N$586  (via drill 1.1 pad 2.1)
  other vias: 31.04,43.25
N$587  (via drill 1.1 pad 2.1)
  other vias: 33.58,43.25
N$588  (via drill 1.1 pad 2.1)
  other vias: 36.12,43.25
N$589  (via drill 1.1 pad 2.1)
  other vias: 38.66,43.25
N$590  (via drill 1.1 pad 2.1)
  other vias: 41.2,43.25
WS2812_DATA_OUT  (via drill 1.1 pad 2.1)
  Top 0.406: JP1.4 43.69,25.42 v43.74,25.47
WS2812_POWER  (via drill 1.1 pad 2.1)
  Top 1.676: JP1.9 51.36,12.73 v51.36,7.69

### Text on the board
tNames: SHA PROTO | Reset | Flash | SDA | LED | IO3 | IO4 | GND | 3V3 | SCL | IO2 | IO1 | IO0 | Vbat | GND